# Altium schematic sheet Synchronous Rectification Stage.SchDoc
size A3
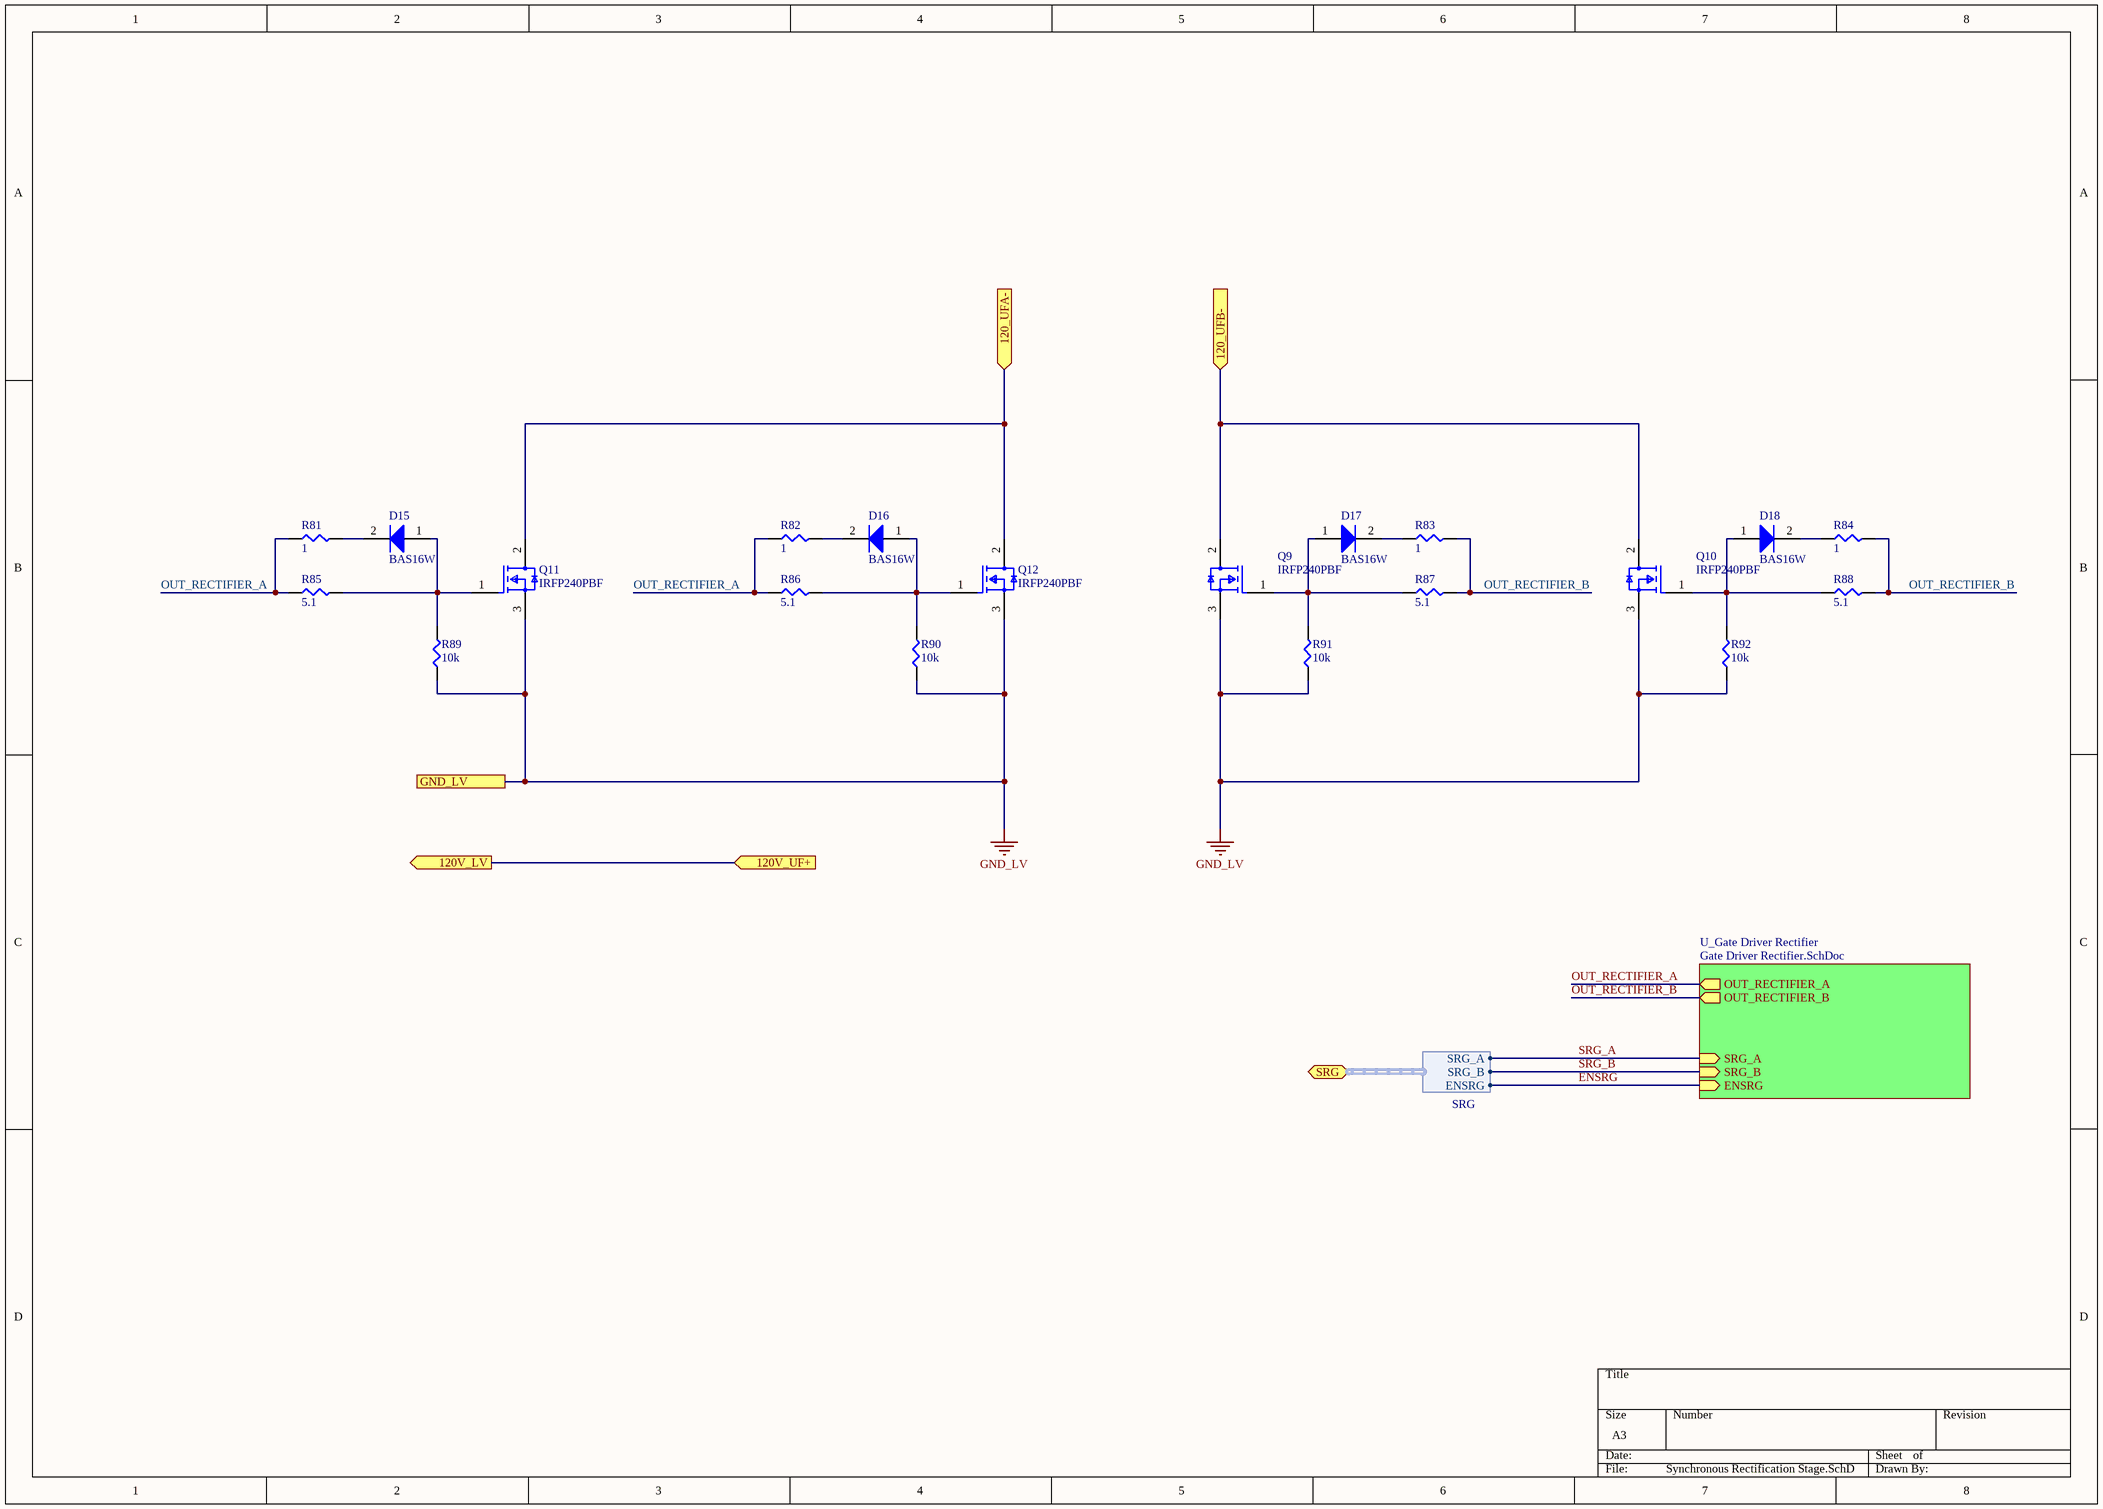
[diagram p0: Synchronous Rectification Stage.SchDoc]

## Parts
D15  BAS16W  [SODFL250X110-2N]
D16  BAS16W  [SODFL250X110-2N]
D17  BAS16W  [SODFL250X110-2N]
D18  BAS16W  [SODFL250X110-2N]
Q9  IRFP240PBF  [FP-E19-0614-MFG]
Q10  IRFP240PBF  [FP-E19-0614-MFG]
Q11  IRFP240PBF  [FP-E19-0614-MFG]
Q12  IRFP240PBF  [FP-E19-0614-MFG]
R81  1  [SMD-0805-RES]
R82  1  [SMD-0805-RES]
R83  1  [SMD-0805-RES]
R84  1  [SMD-0805-RES]
R85  5.1  [SMD-1206-RES]
R86  5.1  [SMD-1206-RES]
R87  5.1  [SMD-1206-RES]
R88  5.1  [SMD-1206-RES]
R89  10k  [SMD-1206-RES]
R90  10k  [SMD-1206-RES]
R91  10k  [SMD-1206-RES]
R92  10k  [SMD-1206-RES]

## Sub-sheets
U_Gate Driver Rectifier = Gate Driver Rectifier.SchDoc: OUT_RECTIFIER_B (out), ENSRG (in), OUT_RECTIFIER_A (out), SRG_A (in), SRG_B (in)

## Ports
120_UFA- (in), 120_UFB- (in), 120V_LV (out), 120V_UF+ (in), GND_LV, SRG (bidir, harness SRG)

## Harnesses
SRG: SRG_A, SRG_B, ENSRG

## Nets
GND_LV: Q9.3(S) Q10.3(S) Q11.3(S) Q12.3(S) R89.1 R90.1 R91.1 R92.1 ; port GND_LV
120_UFA-: Q11.2(D) Q12.2(D) ; port 120_UFA-
120_UFB-: Q9.2(D) Q10.2(D) ; port 120_UFB-
120V_LV: port 120V_LV, port 120V_UF+
ENSRG: sheet U_Gate Driver Rectifier/ENSRG, port SRG.ENSRG
OUT_RECTIFIER_A: R81.1 R82.1 R85.1 R86.1 ; sheet U_Gate Driver Rectifier/OUT_RECTIFIER_A
OUT_RECTIFIER_B: R83.2 R84.2 R87.2 R88.2 ; sheet U_Gate Driver Rectifier/OUT_RECTIFIER_B
SRG_A: sheet U_Gate Driver Rectifier/SRG_A, port SRG.SRG_A
SRG_B: sheet U_Gate Driver Rectifier/SRG_B, port SRG.SRG_B
NetD15_1: D15.1(A) Q11.1(G) R85.2 R89.2
NetD15_2: D15.2(K) R81.2
NetD16_1: D16.1(A) Q12.1(G) R86.2 R90.2
NetD16_2: D16.2(K) R82.2
NetD17_1: D17.1(A) Q9.1(G) R87.1 R91.2
NetD17_2: D17.2(K) R83.1
NetD18_1: D18.1(A) Q10.1(G) R88.1 R92.2
NetD18_2: D18.2(K) R84.1

## Library data of the parts
D15-D18 = BAS16_SOD: Silicon Switching Diode, SOT323, Reel, Green; Manufacturer: Infineon; IR (max): 100Â nA; Configuration: Single; VBR (min): 85Â V; VR (max): 80Â V; trr (max): 4Â ns; Green: TRUE; VF (max): 1.25Â V; IF (max): 250Â mA; Mounting Technology: Surface Mount; PackageReference: SOT323; ComponentLink2URL: http://www.infineon.com/dgdl/bas16series.pdf?folderId=db3a30431400ef6801141b5844e103ea&fileId=db3a30431400ef6801141b93811b03ff; Halogen-free: TRUE; ComponentLink2Description: Datasheet; PartNumber: BAS16W; ComponentLink1Description: Manufacturer URL; ComponentLink3URL: http://www.infineon.com/dgdl/SOT323-Package_Overview.pdf?folderId=db3a30431936bc4b0119533e1dcb3c92&fileId=db3a30431936bc4b011953495f283cb1; ComponentLink1URL: http://www.infineon.com/; PackageDescription: 3-Pin Small Outline Transistor Package, 1.25 x 2 mm Body, 0.65 mm Pitch; ComponentLink3Description: Package Specification
Q9-Q12 = CMP-02550-000013-1: MOSFET N-CH 200V 20A TO-247AC; Manufacturer: Vishay; Threshold Vgs: 4V; Input Capacitace At Vds: 1300pF @ 25V; Threshold Vgs Min: 2V; Reverse Recovery Time: 300ns; Pulse Drain Current: 80A; Depletion Mode: False; Power Dissipation: 150W; Number Of Channels: 1; Turn Off Delay Time: 45ns; Gate Charge At Vgs: 70nC @ 10V; Turn On Delay Time: 14ns; Reverse Recovery Charge: 3400nC; Rthja Max: 40°C/W; Gate To Source Voltage: 20V; Drain To Source Resistance: 0.18Ω; Max Junction Temp: +150°C; Standoff Height: 3.71mm; Category: Trans; Device Class L1: Discrete Semiconductors; Continuous Drain Current: 20A; Manufacturer Part Number: IRFP240PBF; Technology: MOSFET; Temperature Range Low: -55°C; Device Class L3: MOSFETs; Octopart: https://octopart.com/irfp240pbf-vishay-46527395; RoHS: TRUE; Threshold Vgs Max: 4V; Max Forward Diode Voltage: 2V; Lead Free: Yes; Mouser Description: MOSFET N-Chan 200V 20 Amp; Temperature Range High: +150°C; ComponentLink2Description: Datasheet; Number Of N Channels: 1; Height: 25.11mm; Ipc Land Pattern Name: TO-220; Temperature: -55°C to +150°C; Device Class L2: Transistors; ComponentLink2URL: http://www.vishay.com/docs/91210/91210.pdf; Package: E19-0614; Drain To Source Voltage: 200V; Digikey Description: MOSFET N-CH 200V 20A TO-247AC; Automotive: No; Drain To Source Breakdown Voltage: 200V
R81-R84 = ERJ-6BQF1R0V: RES SMD 1 OHM 1% 1/3W 0805; Manufacturer: Panasonic Electronic Components; Factory Stock: 0; Unit Price (USD): 0.05834; @ qty: 1500; Power (Watts): 0.333W, 1/3W; Temperature Coefficient: ±200ppm/°C; Part Number: ERJ-6BQF1R0V; Datasheets: https://industrial.panasonic.com/cdbs/www-data/pdf/RDA0000/AOA0000C239.pdf; Image: //media.digikey.com/Renders/Panasonic%20Renders/ERJ-0805%20Pkg.jpg; Digi-Key Part Number: P17499CT-ND; Quantity Available: 808; Minimum Quantity: 1; Packaging: Cut Tape (CT); Series: ERJ; Part Status: Active; Value: 1; Tolerance: ±1%; Composition: Thick Film; Features: Automotive AEC-Q200, Current Sense; Operating Temperature: -55°C ~ 125°C; Package / Case: 0805 (2012 Metric); Supplier Device Package: 0805; Size / Dimension: 0.079" L x 0.049" W (2.00mm x 1.25mm); Height - Seated (Max): 0.028" (0.70mm); Number of Terminations: 2; Failure Rate: -
R85-R88 = ERJ-8BQF5R1V: RES SMD 5.1 OHM 1% 1/2W 1206; Manufacturer: Panasonic Electronic Components; Factory Stock: 0; Unit Price (USD): 0.05778; @ qty: 1500; Minimum Quantity: 1; Power (Watts): 0.5W, 1/2W; Temperature Coefficient: ±200ppm/°C; Part Number: ERJ-8BQF5R1V; Datasheets: https://industrial.panasonic.com/cdbs/www-data/pdf/RDA0000/AOA0000C239.pdf; Image: //media.digikey.com/Renders/Panasonic%20Renders/ERJ-1206%20Pkg.jpg; Digi-Key Part Number: P17617CT-ND; Quantity Available: 4802; Packaging: Cut Tape (CT); Series: ERJ; Part Status: Active; Value: 5.1; Tolerance: ±1%; Composition: Thick Film; Features: Automotive AEC-Q200, Current Sense; Operating Temperature: -55°C ~ 125°C; Package / Case: 1206 (3216 Metric); Supplier Device Package: 1206; Size / Dimension: 0.126" L x 0.063" W (3.20mm x 1.60mm); Height - Seated (Max): 0.028" (0.70mm); Number of Terminations: 2; Failure Rate: -
R89-R92 = ERJ-8ENF1002V: RES SMD 10K OHM 1% 1/4W 1206; Manufacturer: Panasonic Electronic Components; Factory Stock: 0; Unit Price (USD): 0.00933; @ qty: 1500; Minimum Quantity: 1; Power (Watts): 0.25W, 1/4W; Temperature Coefficient: ±100ppm/°C; Part Number: ERJ-8ENF1002V; Datasheets: http://industrial.panasonic.com/www-cgi/jvcr13pz.cgi?E+PZ+3+AOA0002+ERJ8ENF1002V+7+WW; Image: //media.digikey.com/Renders/Panasonic%20Renders/ERJ-1206%20Pkg.jpg; Digi-Key Part Number: P10.0KFCT-ND; Quantity Available: 1108398; Packaging: Cut Tape (CT); Series: ERJ; Part Status: Active; Value: 10k; Tolerance: ±1%; Composition: Thick Film; Features: Automotive AEC-Q200; Operating Temperature: -55°C ~ 155°C; Package / Case: 1206 (3216 Metric); Supplier Device Package: 1206; Size / Dimension: 0.126" L x 0.063" W (3.20mm x 1.60mm); Height - Seated (Max): 0.028" (0.70mm); Number of Terminations: 2; Failure Rate: -